# EAGLE schematic schema_mpb1_1 (EAGLE 9.0.1)

## Sheet 1 of 4: Power Conversion
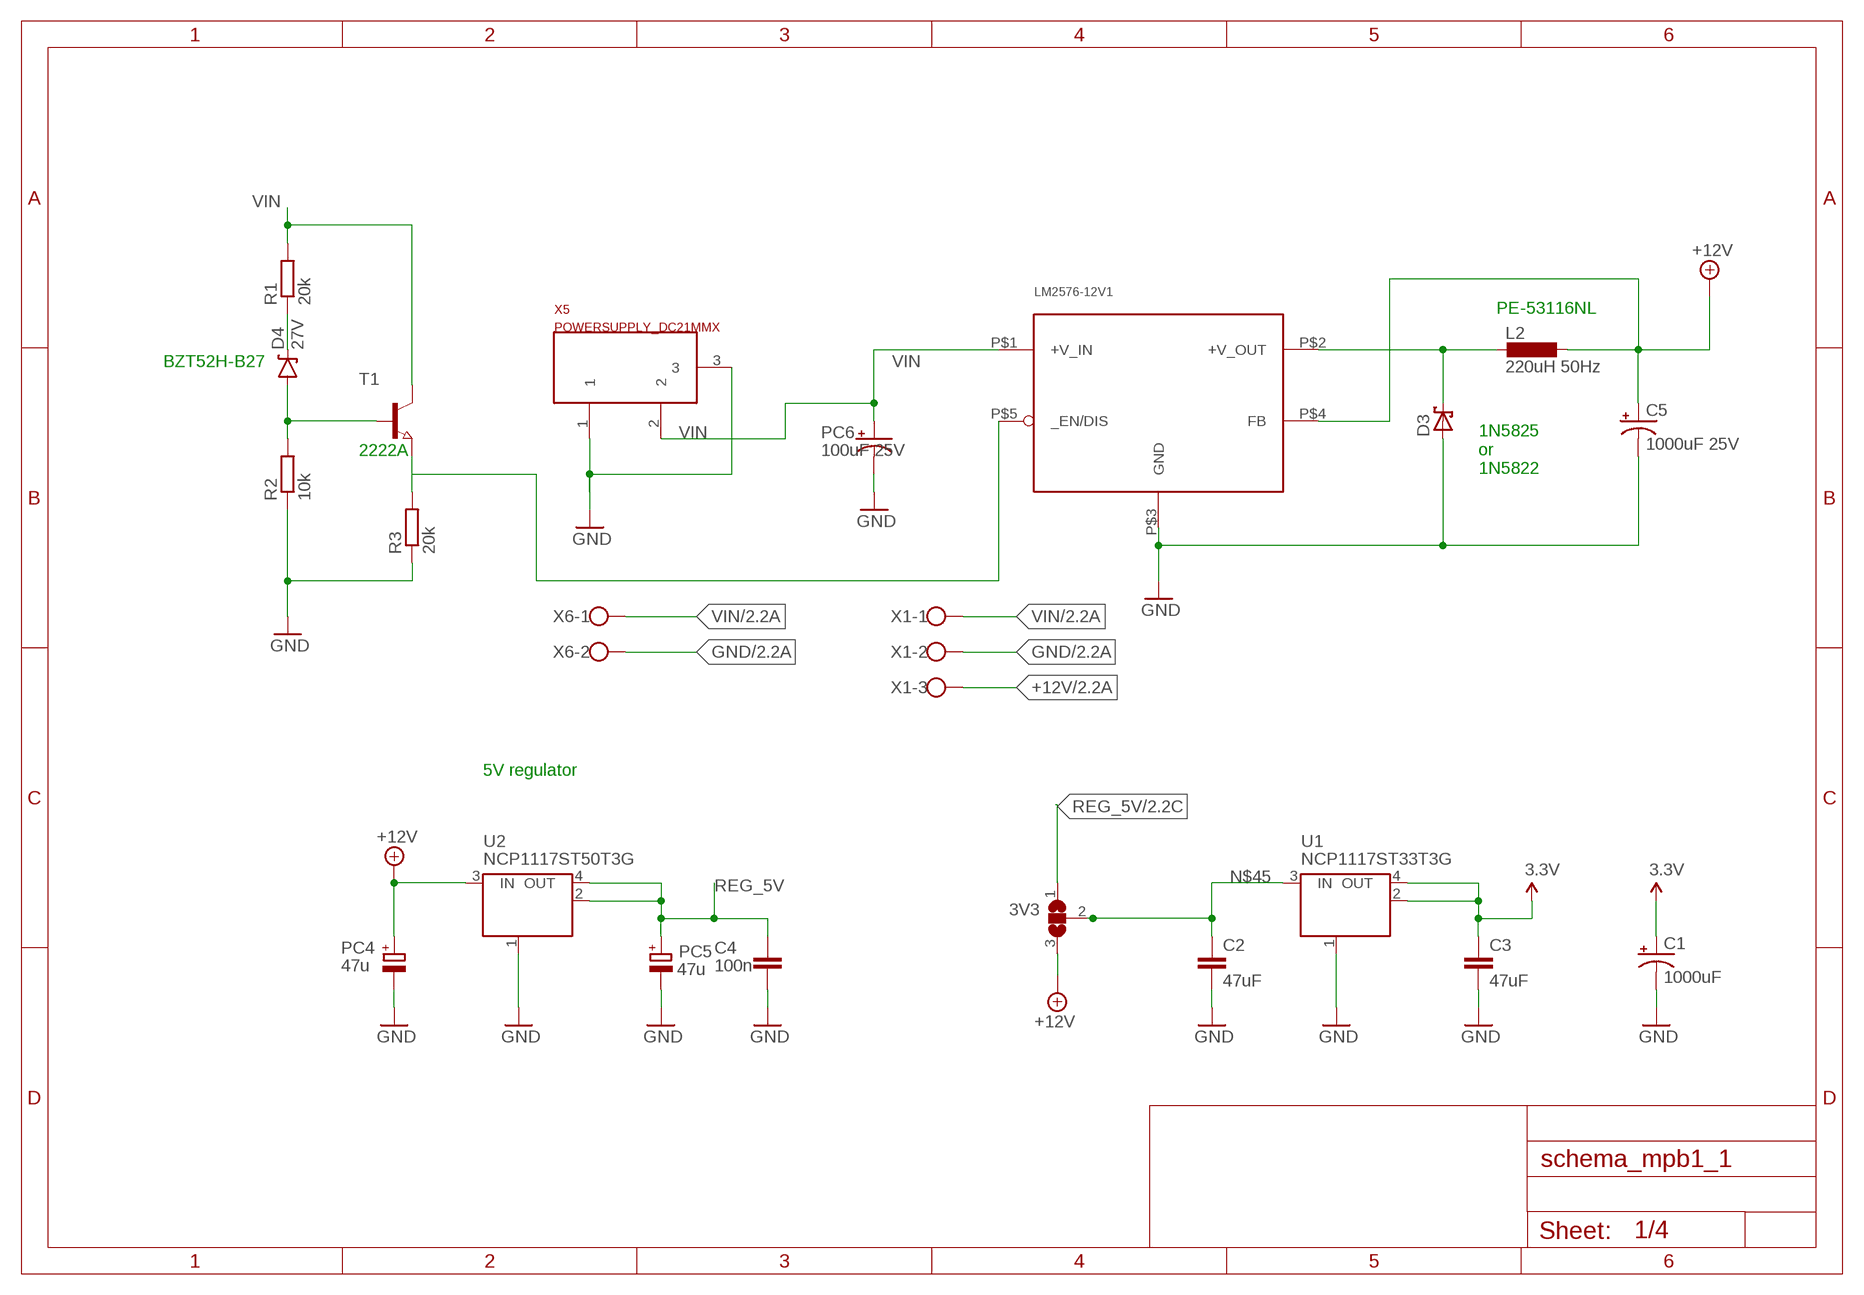
[diagram p0: schematic, sheet 1]

### Parts
3V3  SJ2W  [SJ_2]
C1  1000uF  CPOL-USE5-6  [E5-6]
C2  47uF  C-EUC0603  [C0603]
C3  47uF  C-EUC0603  [C0603]
C4  100n  C-EU0603-RND  [C0603-ROUND]
C5  1000uF 25V  CPOL-USE5-6  [E5-6]
D3  1N5908  [C4111-15]
D4  27V  DIODE-ZENER16V  [SOD-123]
L2  220uH 50Hz  L-KM4.0  [KM-4.0]
LM2576-12V1  LM2576-T05D  [TO220-5_STAGGERED]
PC4  47u  CPOL-EUD  [PANASONIC_D]
PC5  47u  CPOL-EUD  [PANASONIC_D]
PC6  100uF 25V  CPOL-USE5-6  [E5-6]
R1  20k  R-EU_R0603  [R0603]
R2  10k  R-EU_R0603  [R0603]
R3  20k  R-EU_R0603  [R0603]
T1  NPN-TRANSISTOR_SOT23  [SOT23]
U1  NCP1117ST33T3G  MC33269ST-3.3T3  [SOT223]
U2  NCP1117ST50T3G  MC33269ST-3.3T3  [SOT223]
X1  W237-103  [W237-103]
X5  POWERSUPPLY_DC21MMX  [POWERSUPPLY_DC-21MM]
X6  W237-102  [W237-102]

### Nets
3.3V [power]: C1.+ C3.1 U1.2(OUT) U1.4(OUT) ; also sheet 2
+12V: 3V3.3 C5.+ L2.P$2 LM2576-12V1.P$4(FB) PC4.+ U2.3(IN) X1.3 ; also sheet 2
GND [gnd]: C1.- C2.2 C3.2 C4.1 C5.- D3.A LM2576-12V1.P$3(GND) PC4.- PC5.- PC6.- R2.1 R3.1 U1.1(GND/ADJ) U2.1(GND/ADJ) X1.2 X5.1 X5.3 X6.2 ; also sheet 2
N$1: D3.C L2.P$1 LM2576-12V1.P$2(+V_OUT)
N$2: D4.A R2.2 T1.1(B)
N$3: D4.C R1.1
N$4 [gnd]: LM2576-12V1.P$5(_EN/DIS) R3.2 T1.2(E)
N$45: 3V3.2 C2.1 U1.3(IN)
REG_5V: 3V3.1 C4.2 PC5.+ U2.2(OUT) U2.4(OUT) ; also sheet 2
VIN [power]: LM2576-12V1.P$1(+V_IN) PC6.+ R1.2 T1.3(C) X1.1 X5.2 X6.1 ; also sheet 2

### Notes on the sheet
- PE-53116NL
- BZT52H-B27
- 2222A
- 1N5825
  or
  1N5822
- 5V regulator

## Sheet 2 of 4: General Board Outline
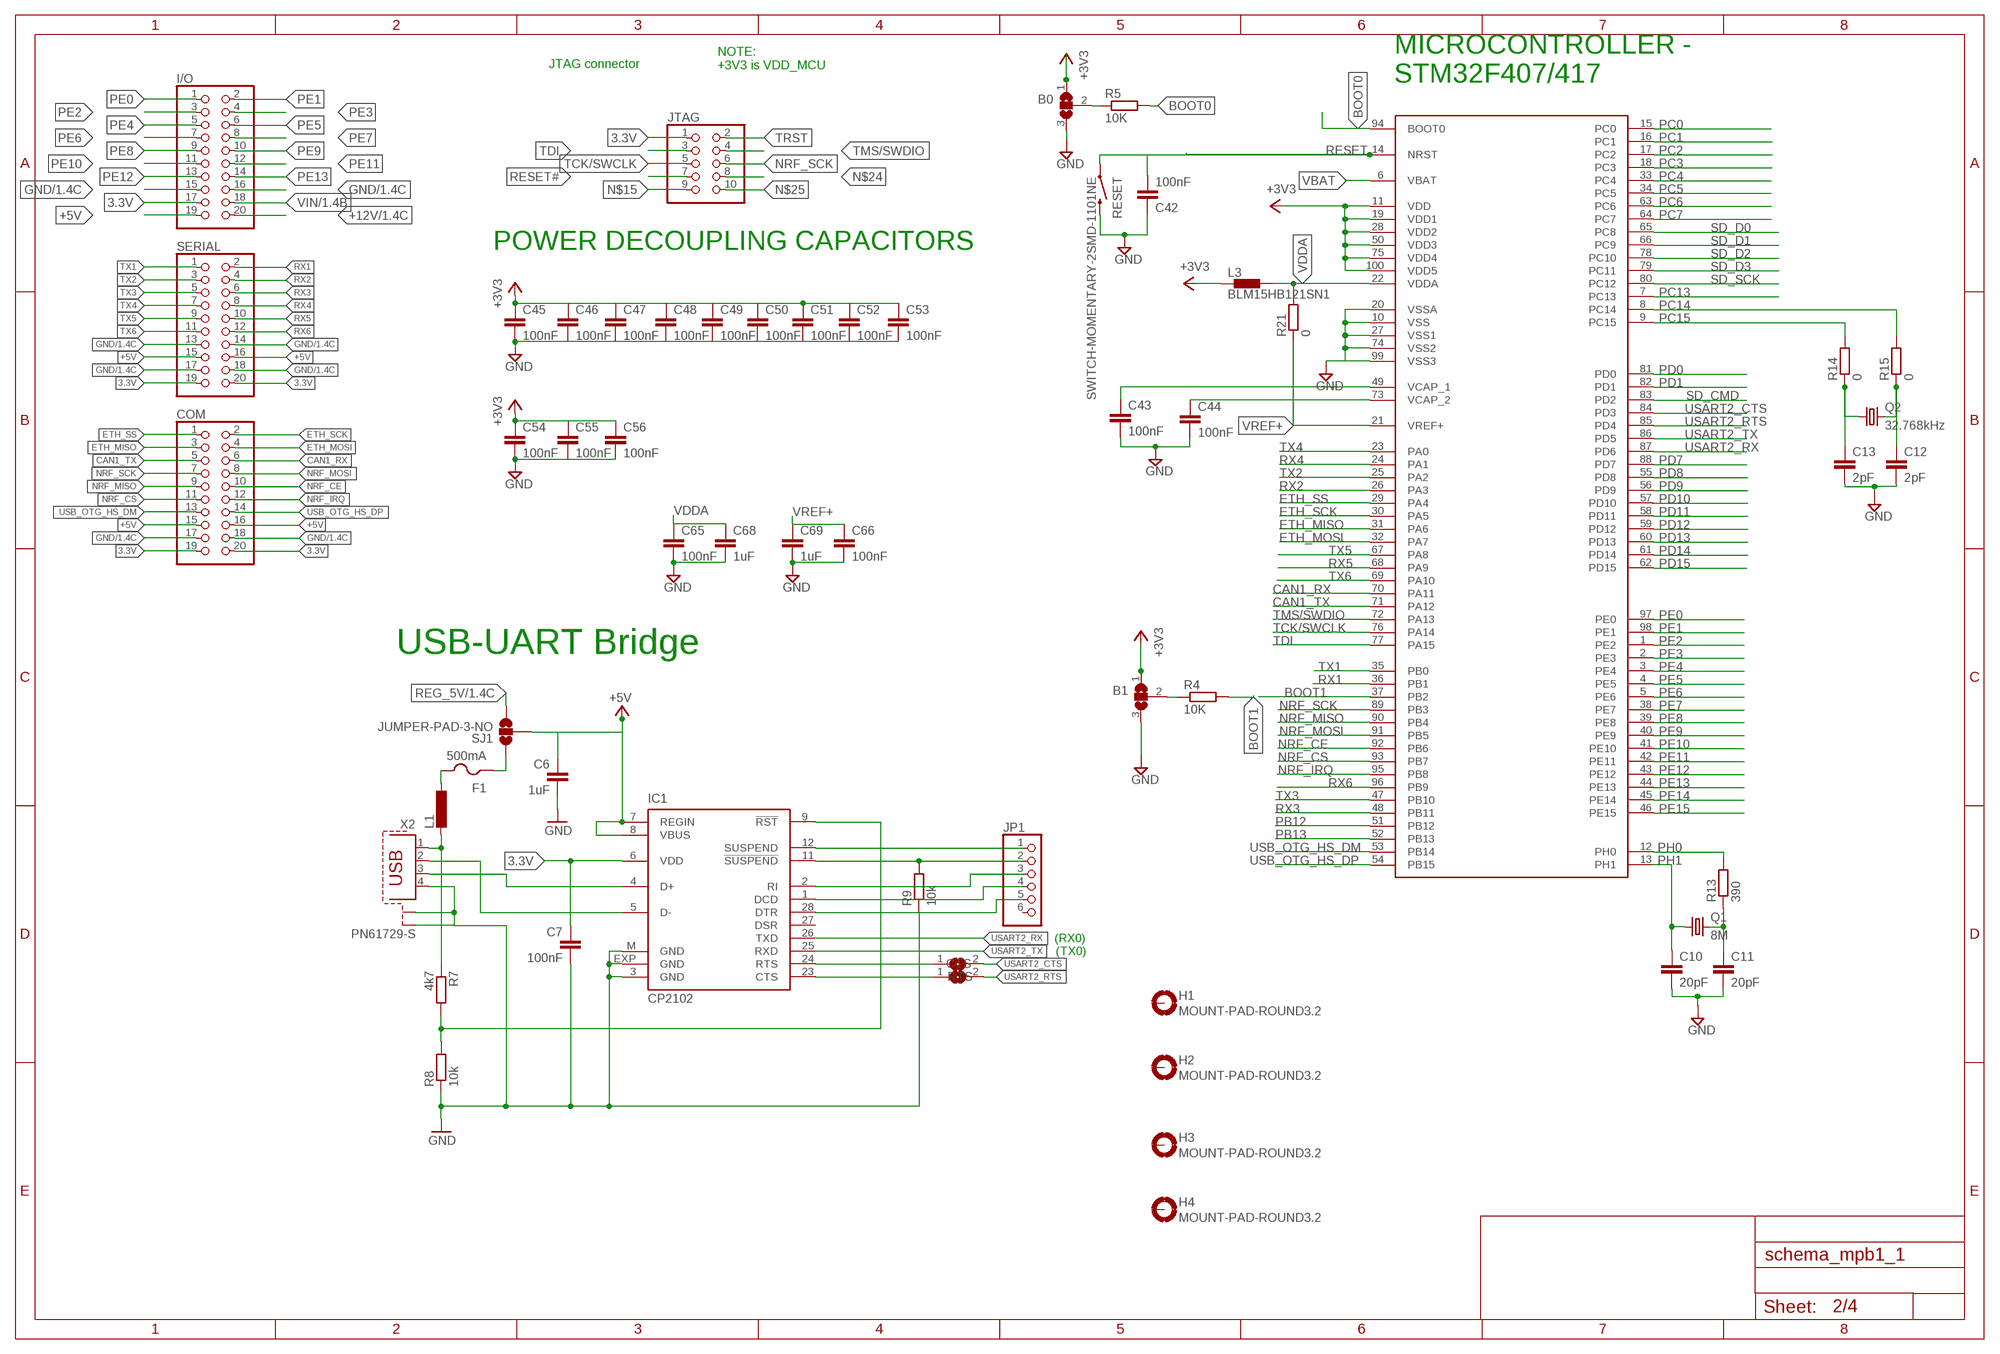
[diagram p1: schematic, sheet 2]

### Parts
B0  SJ2W  [SJ_2]
B1  SJ2W  [SJ_2]
C6  1uF  C-EU0603-RND  [C0603-ROUND]
C7  100nF  C-EU0603-RND  [C0603-ROUND]
C10  20pF  C-EUC0603  [C0603]
C11  20pF  C-EUC0603  [C0603]
C12  2pF  C-EUC0603  [C0603]
C13  2pF  C-EUC0603  [C0603]
C42  100nF  C-EUC0603  [C0603]
C43  100nF  C-EUC0603  [C0603]
C44  100nF  C-EUC0603  [C0603]
C45  100nF  C-EUC0603  [C0603]
C46  100nF  C-EUC0603  [C0603]
C47  100nF  C-EUC0603  [C0603]
C48  100nF  C-EUC0603  [C0603]
C49  100nF  C-EUC0603  [C0603]
C50  100nF  C-EUC0603  [C0603]
C51  100nF  C-EUC0603  [C0603]
C52  100nF  C-EUC0603  [C0603]
C53  100nF  C-EUC0603  [C0603]
C54  100nF  C-EUC0603  [C0603]
C55  100nF  C-EUC0603  [C0603]
C56  100nF  C-EUC0603  [C0603]
C65  100nF  C-EUC0603  [C0603]
C66  100nF  C-EUC0603  [C0603]
C68  1uF  C-EUC0603  [C0603]
C69  1uF  C-EUC0603  [C0603]
COM  PINHD-2X10_2.54  [2X10]
CTS  SJ  [SJ]
F1  500mA  PTCFUSE-1812  [1812]
H1  MOUNT-PAD-ROUND3.2  [3,2-PAD]
H2  MOUNT-PAD-ROUND3.2  [3,2-PAD]
H3  MOUNT-PAD-ROUND3.2  [3,2-PAD]
H4  MOUNT-PAD-ROUND3.2  [3,2-PAD]
I/O  PINHD-2X10_2.54  [2X10]
IC1  CP2102  [MLP28]
JP1  PINHD-1X6  [1X06]
JTAG  PINHD-2X05_2.00  [2X05M]
L1  L-EUL1812  [L1812]
L3  BLM15HB121SN1  [0402]
Q1  8M  CRYSTALHC49UP  [HC49UP]
Q2  32.768kHz  CRYSTALHC49UP  [HC49UP]
R4  10K  R-EU_R0603  [R0603]
R5  10K  R-EU_R0603  [R0603]
R7  4k7  R-EU_R0603  [R0603]
R8  10k  R-EU_R0603  [R0603]
R9  10k  R-EU_R0603  [R0603]
R13  390  R-EU_R0603  [R0603]
R14  0  R-EU_R0603  [R0603]
R15  0  R-EU_R0603  [R0603]
R21  0  R-EU_R0603  [R0603]
RESET  SWITCH-MOMENTARY-2SMD-1101NE  [TACTILE-SWITCH-1101NE]
RTS  SJ  [SJ]
SERIAL  PINHD-2X10_2.54  [2X10]
SJ1  JUMPER-PAD-3-NO  [PAD-JUMPER-3-NO_YES_SILK_FULL_BOX_WIDE_SPACING]
U$2  STM32F40XSTM32D40X  [LQFP100]
X2  PN61729-S  [PN61729-S]

### Nets
3.3V [power]: B0.1 B1.1 C7.1 C45.1 C46.1 C47.1 C48.1 C49.1 C50.1 C51.1 C52.1 C53.1 C54.1 C55.1 C56.1 COM.19 COM.20 I/O.17 IC1.6(VDD) JTAG.1 L3.1 SERIAL.19 SERIAL.20 U$2.11(VDD) U$2.19(VDD1) U$2.28(VDD2) U$2.50(VDD3) U$2.75(VDD4) U$2.100(VDD5) ; supply symbol labelled +3V3 ; also sheet 1
+5V [power usb]: C6.1 COM.15 COM.16 I/O.19 IC1.7(REGIN) IC1.8(VBUS) SERIAL.15 SERIAL.16 SJ1.2
+12V: I/O.20 ; also sheet 1
BOOT0: R5.2 U$2.94(BOOT0)
BOOT1: R4.2 U$2.37(PB2)
CAN1_RX: COM.6 U$2.70(PA11)
CAN1_TX: COM.5 U$2.71(PA12)
ETH_MISO: COM.3 U$2.31(PA6)
ETH_MOSI: COM.4 U$2.32(PA7)
ETH_SCK: COM.2 U$2.30(PA5)
ETH_SS: COM.1 U$2.29(PA4)
GND [gnd]: B0.3 B1.3 C6.2 C7.2 C10.2 C11.2 C12.2 C13.2 C42.1 C43.2 C44.2 C45.2 C46.2 C47.2 C48.2 C49.2 C50.2 C51.2 C52.2 C53.2 C54.2 C55.2 C56.2 C65.2 C66.2 C68.2 C69.2 COM.17 COM.18 I/O.15 I/O.16 IC1.3(GND) IC1.EXP(GND) IC1.M(GND) R8.1 R9.1 RESET.2 SERIAL.13 SERIAL.14 SERIAL.17 SERIAL.18 U$2.10(VSS) U$2.20(VSSA) U$2.27(VSS1) U$2.74(VSS2) U$2.99(VSS3) X2.4 X2.S1 X2.S2 ; also sheet 1
N$5: B1.2 R4.1
N$6: B0.2 R5.1
N$8: IC1.9(!RST) R7.2 R8.2
N$9: C11.1 Q1.2 R13.1
N$10: C12.1 Q2.2 R15.1
N$11: IC1.2(RI) JP1.3
N$12: C13.1 Q2.1 R14.1
N$13: IC1.5(D-) X2.2
N$14: IC1.4(D+) X2.3
N$15: JTAG.9
N$16: C44.1 U$2.73(VCAP_2)
N$17: L1.2 R7.1 X2.1
N$18: F1.2 L1.1
N$19: IC1.1(DCD) JP1.4
N$20: C43.1 U$2.49(VCAP_1)
N$21: IC1.11(!SUSPEND) JP1.2 R9.2
N$24: JTAG.8
N$25: JTAG.10
N$26: IC1.12(SUSPEND) JP1.1
N$27: IC1.28(DTR) JP1.5
N$41: CTS.1 IC1.24(RTS)
N$44: IC1.23(CTS) RTS.1
NRF_CE: COM.10 U$2.92(PB6)
NRF_CS: COM.11 U$2.93(PB7)
NRF_IRQ: COM.12 U$2.95(PB8)
NRF_MISO: COM.9 U$2.90(PB4)
NRF_MOSI: COM.8 U$2.91(PB5)
NRF_SCK: COM.7 JTAG.6 U$2.89(PB3)
PB12: U$2.51(PB12)
PB13: U$2.52(PB13)
PC0: U$2.15(PC0)
PC1: U$2.16(PC1)
PC2: U$2.17(PC2)
PC3: U$2.18(PC3)
PC4: U$2.33(PC4)
PC5: U$2.34(PC5)
PC6: U$2.63(PC6)
PC7: U$2.64(PC7)
PC13: U$2.7(PC13)
PC14: R15.2 U$2.8(PC14)
PC15: R14.2 U$2.9(PC15)
PD0: U$2.81(PD0)
PD1: U$2.82(PD1)
PD7: U$2.88(PD7)
PD8: U$2.55(PD8)
PD9: U$2.56(PD9)
PD10: U$2.57(PD10)
PD11: U$2.58(PD11)
PD12: U$2.59(PD12)
PD13: U$2.60(PD13)
PD14: U$2.61(PD14)
PD15: U$2.62(PD15)
PE0: I/O.1 U$2.97(PE0)
PE1: I/O.2 U$2.98(PE1)
PE2: I/O.3 U$2.1(PE2)
PE3: I/O.4 U$2.2(PE3)
PE4: I/O.5 U$2.3(PE4)
PE5: I/O.6 U$2.4(PE5)
PE6: I/O.7 U$2.5(PE6)
PE7: I/O.8 U$2.38(PE7)
PE8: I/O.9 U$2.39(PE8)
PE9: I/O.10 U$2.40(PE9)
PE10: I/O.11 U$2.41(PE10)
PE11: I/O.12 U$2.42(PE11)
PE12: I/O.13 U$2.43(PE12)
PE13: I/O.14 U$2.44(PE13)
PE14: U$2.45(PE14)
PE15: U$2.46(PE15)
PH0: R13.2 U$2.12(PH0)
PH1: C10.1 Q1.1 U$2.13(PH1)
REG_5V: SJ1.3 ; also sheet 1
RESET: C42.2 RESET.1 U$2.14(NRST)
RESET#: JTAG.7
RX1: SERIAL.2 U$2.36(PB1)
RX2: SERIAL.4 U$2.26(PA3)
RX3: SERIAL.6 U$2.48(PB11)
RX4: SERIAL.8 U$2.24(PA1)
RX5: SERIAL.10 U$2.68(PA9)
RX6: SERIAL.12 U$2.96(PB9)
SD_CMD: U$2.83(PD2)
SD_D0: U$2.65(PC8)
SD_D1: U$2.66(PC9)
SD_D2: U$2.78(PC10)
SD_D3: U$2.79(PC11)
SD_SCK: U$2.80(PC12)
TCK/SWCLK: JTAG.5 U$2.76(PA14)
TDI: JTAG.3 U$2.77(PA15)
TMS/SWDIO: JTAG.4 U$2.72(PA13)
TRST: JTAG.2
TX1: SERIAL.1 U$2.35(PB0)
TX2: SERIAL.3 U$2.25(PA2)
TX3: SERIAL.5 U$2.47(PB10)
TX4: SERIAL.7 U$2.23(PA0)
TX5: SERIAL.9 U$2.67(PA8)
TX6: SERIAL.11 U$2.69(PA10)
USART2_CTS: CTS.2 U$2.84(PD3)
USART2_RTS: RTS.2 U$2.85(PD4)
USART2_RX: IC1.26(TXD) U$2.87(PD6)
USART2_TX: IC1.25(RXD) U$2.86(PD5)
USB_OTG_HS_DM: COM.13 U$2.53(PB14)
USB_OTG_HS_DP: COM.14 U$2.54(PB15)
VBAT: U$2.6(VBAT)
VDDA: C65.1 C68.1 L3.2 R21.2 U$2.22(VDDA)
VIN [power]: I/O.18 ; also sheet 1
VREF+: C66.1 C69.1 R21.1 U$2.21(VREF+)
VUSB2: F1.1 SJ1.1
Unconnected: H1.B3,2(MOUNT) H2.B3,2(MOUNT) H3.B3,2(MOUNT) H4.B3,2(MOUNT) IC1.27(DSR) JP1.6

### Notes on the sheet
- JTAG connector
- NOTE:
  +3V3 is VDD_MCU
- MICROCONTROLLER - 
  STM32F407/417
- POWER DECOUPLING CAPACITORS
- USB-UART Bridge
- (RX0)
- (TX0)

## Sheet 3 of 4: Logo
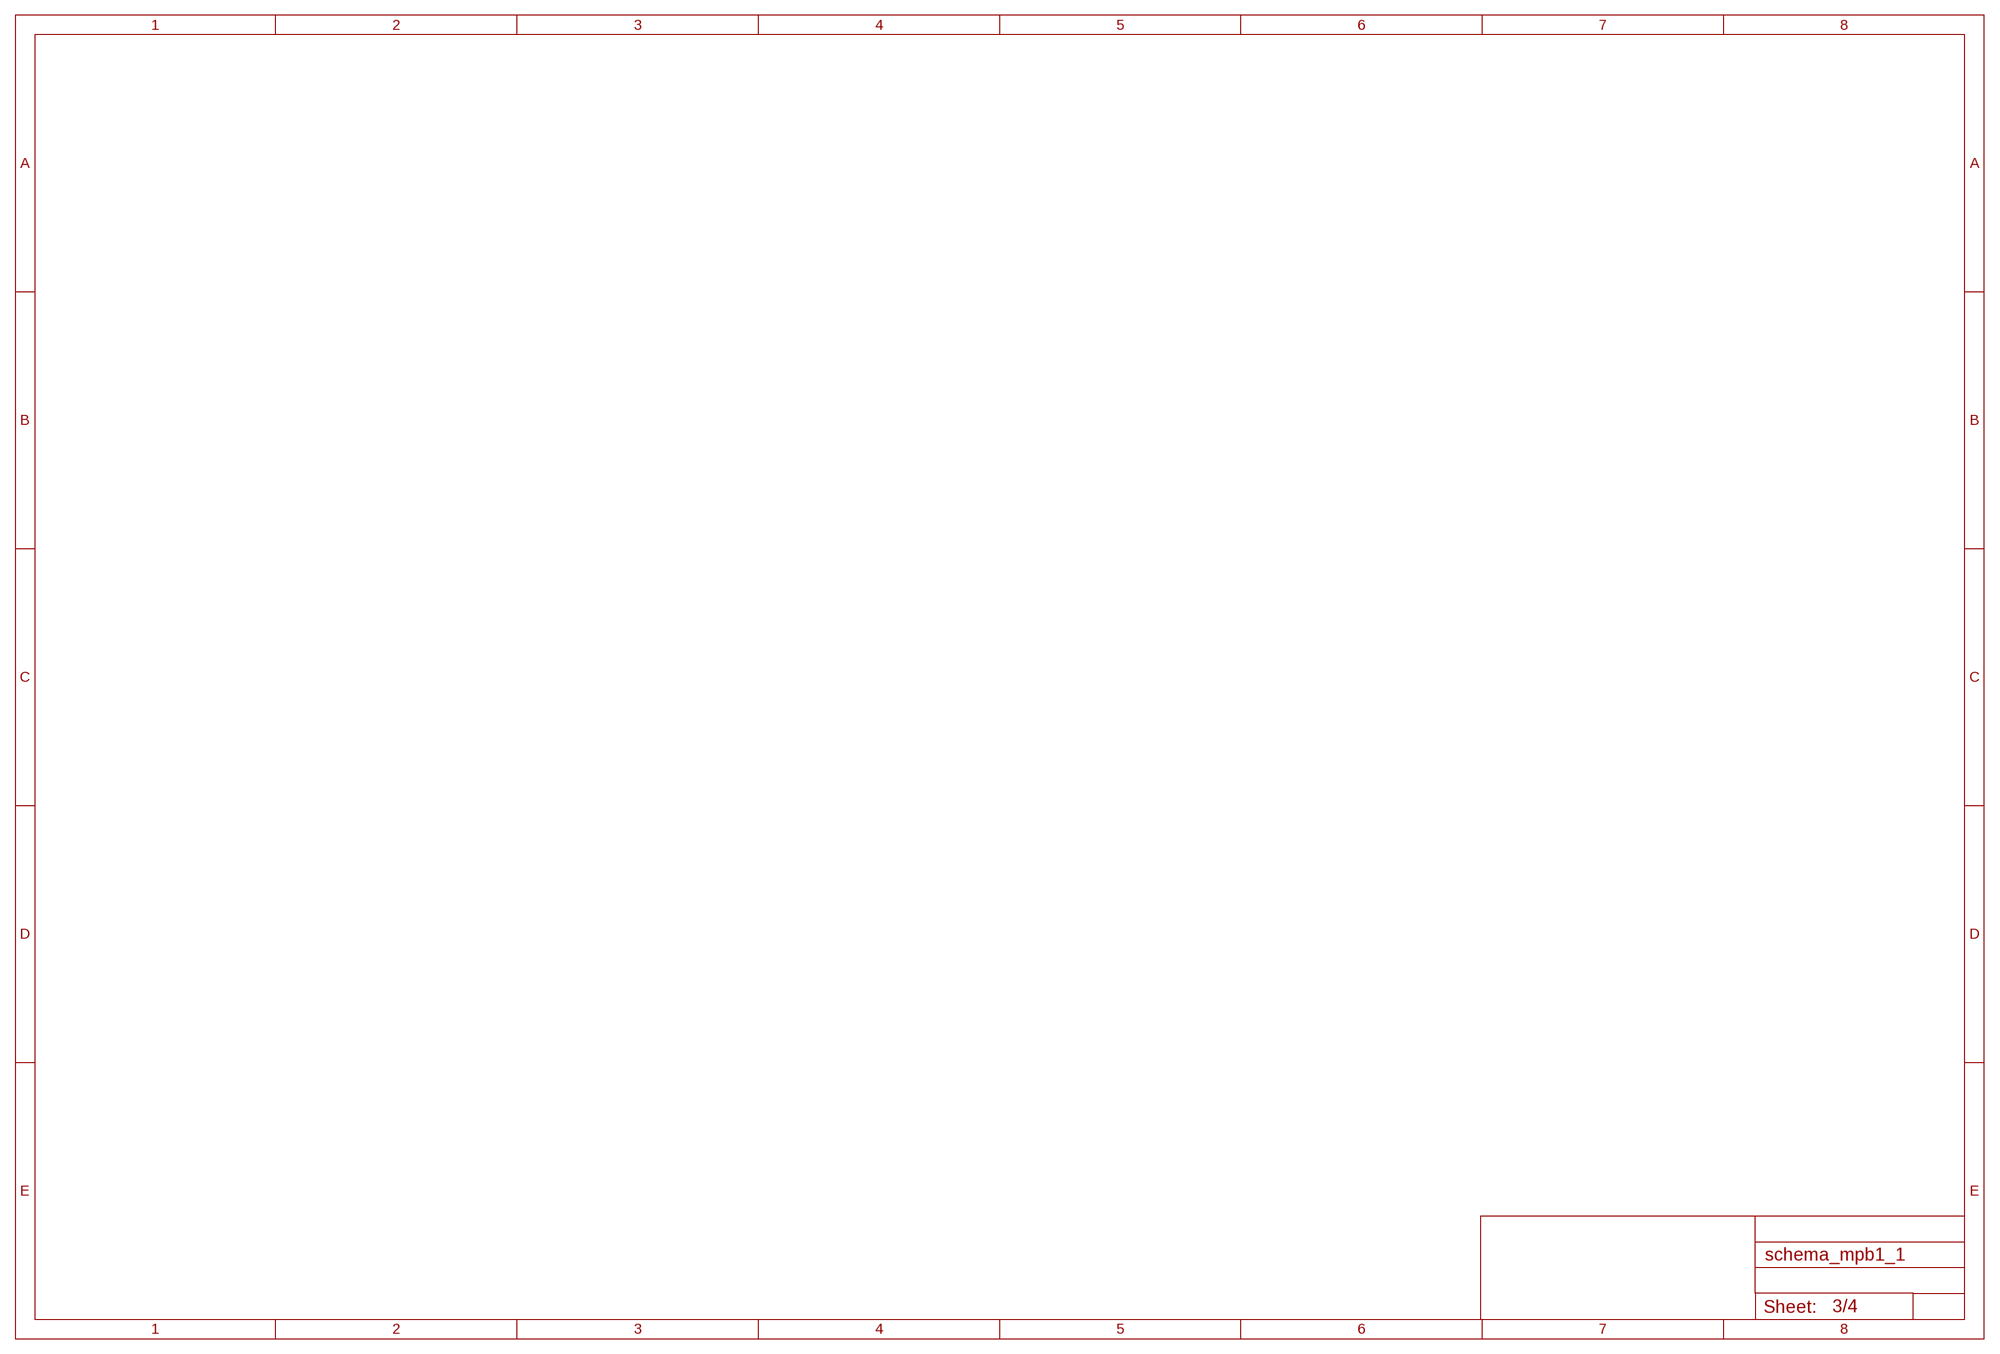
[diagram p2: schematic, sheet 3]

## Sheet 4 of 4

## Library data of the parts
3V3 B0 B1 = jumper:SJ2W: SMD solder JUMPER
C1 C5 PC6 = adafruit:CPOL-US: POLARIZED CAPACITOR, American symbol
C2 C3 = rcl:C-EU: CAPACITOR, European symbol
C4 C6 C7 = SmartPrj:C-EU: CAPACITOR, European symbol
C10-C13 C42-C56 C65 C66 C68 C69 = resistor:C-EU: CAPACITOR, European symbol
COM I/O SERIAL = pinhead-2:PINHD-2X10: PIN HEADER
CTS RTS = jumper:SJ: SMD solder JUMPER
D3 = diode:1N5908: DIODE schottky
D4 = SparkFun-DiscreteSemi:DIODE-ZENER: Zener Diode Production Part - 8199 3.4V Zener Voltage; PROD_ID: DIO-12440; VALUE: 16V
F1 = adafruit:PTCFUSE: PTC fuses, resettable thermistors
H1-H4 = holes:MOUNT-PAD-ROUND: MOUNTING PAD, round
IC1 = silabs-2:CP210*: Single-Chip USB to UART Bridge Source: www.silabs.com .. CP2101.pdf / cp2102.pdf
JP1 = pinhead:PINHD-1X6: PIN HEADER
JTAG = pinhead-2:PINHD-2X05: PIN HEADER
L1 = rcl:L-EU: INDUCTOR, European symbol
L2 = inductor_Noyle:L-KM4.0
L3 = inductors:BLM15H: EMIFIL (R) Chip Ferrite Bead for GHz Noise Source: http://www.murata.com/ Ferrite Bead BLM15H.pdf
LM2576-12V1 = LM2576:LM2576-T05D: LM2576/LM2576HV Series SIMPLE SWITCHER® 3A Step-Down Voltage Regulator STAGGERED PACKAGE
PC4 PC5 = rcl:CPOL-EU: POLARIZED CAPACITOR, European symbol
Q1 Q2 = crystal:CRYSTAL: CRYSTAL; OC_FARNELL: unknown; OC_NEWARK: unknown
R1-R3 = rcl:R-EU_: RESISTOR, European symbol
R4 R5 = rcl:R-EU_: RESISTOR, European symbol; SPICEPREFIX: R
R7-R9 R13-R15 R21 = resistor:R-EU_: RESISTOR, European symbol
RESET = SparkFun-Electromechanical:SWITCH-MOMENTARY-2: Various NO switches- pushbuttons, reed, etc; PROD_ID: SWCH-00815
SJ1 = SparkFun-Passives:JUMPER-PAD-3-NO
T1 = semicon-smd-ipc:NPN-TRANSISTOR_: NPN TRANSISTOR
U1 U2 = linear:MC33269ST*: Adjustable Output Low Dropout Voltage Regulator 800 mA Source: http://www.onsemi.com/pub/Collateral/MC33269-D.PDF
U$2 = stm32f:STM32F40X: Features • Core: ARM 32-bit Cortex™-M4 CPU with FPU, Adaptive real-time accelerator (ART Accelerator™) allowing 0-wait state execution from Flash memory, frequency up to 168 MHz, memory protection unit, 210 DMIPS/ 1.25 DMIPS/MHz (Dhrystone 2.1), and DSP instructions • Memories – Up to 1 Mbyte of Flash memory – Up to 192+4 Kbytes of SRAM including 64- Kbyte of CCM (core coupled memory) data RAM – Flexible static memory controller supporting Compact Flash, SRAM, PSRAM, NOR and NAND memories • LCD parallel interface, 8080/6800 modes • Clock, reset and supply management – 1.8 V to 3.6 V application supply and I/Os – POR, PDR, PVD and BOR – 4-to-26 MHz crystal oscillator – Internal 16 MHz factory-trimmed RC (1% accuracy) – 32 kHz oscillator for RTC with calibration – Internal 32 kHz RC with calibration • Low power – Sleep, Stop and Standby modes – VBAT supply for RTC, 20×32 bit backup registers + optional 4 KB backup SRAM • 3×12-bit, 2.4 MSPS A/D converters: up to 24 channels and 7.2 MSPS in triple interleaved mode • 2×12-bit D/A converters • General-purpose DMA: 16-stream DMA controller with FIFOs and burst support • Up to 17 timers: up to twelve 16-bit and two 32- bit timers up to 168 MHz, each with up to 4 IC/OC/PWM or pulse counter and quadrature (incremental) encoder input • Debug mode – Serial wire debug (SWD) & JTAG interfaces – Cortex-M4 Embedded Trace Macrocell™ • Up to 140 I/O ports with interrupt capability – Up to 136 fast I/Os up to 84 MHz – Up to 138 5 V-tolerant I/Os • Up to 15 communication interfaces – Up to 3 × I2C interfaces (SMBus/PMBus) – Up to 4 USARTs/2 UARTs (10.5 Mbit/s, ISO 7816 interface, LIN, IrDA, modem control) – Up to 3 SPIs (42 Mbits/s), 2 with muxed full-duplex I2S to achieve audio class accuracy via internal audio PLL or external clock – 2 × CAN interfaces (2.0B Active) – SDIO interface • Advanced connectivity – USB 2.0 full-speed device/host/OTG controller with on-chip PHY – USB 2.0 high-speed/full-speed device/host/OTG controller with dedicated DMA, on-chip full-speed PHY and ULPI – 10/100 Ethernet MAC with dedicated DMA: supports IEEE 1588v2 hardware, MII/RMII • 8- to 14-bit parallel camera interface up to 54 Mbytes/s • True random number generator • CRC calculation unit • 96-bit unique ID • RTC: subsecond accuracy, hardware calendar
X1 = con-wago-500:W237-103: WAGO SCREW CLAMP; MPN: 237-103; OC_FARNELL: unknown; OC_NEWARK: 18M7116
X2 = con-berg:PN61729-S: BERG USB connector; OC_FARNELL: unknown; OC_NEWARK: unknown
X5 = SmartPrj:POWERSUPPLY_DC21MM
X6 = con-wago-500:W237-102: WAGO SCREW CLAMP; MPN: 237-102; OC_FARNELL: unknown; OC_NEWARK: 70K9898

## Net classes
1 power: width 0.152 mm, drill 0.152 mm, clearance 0.152 mm
2 gnd: width 0.152 mm, drill 0.152 mm, clearance 0.152 mm
3 power usb: width 0.152 mm, drill 0.152 mm, clearance 0.152 mm